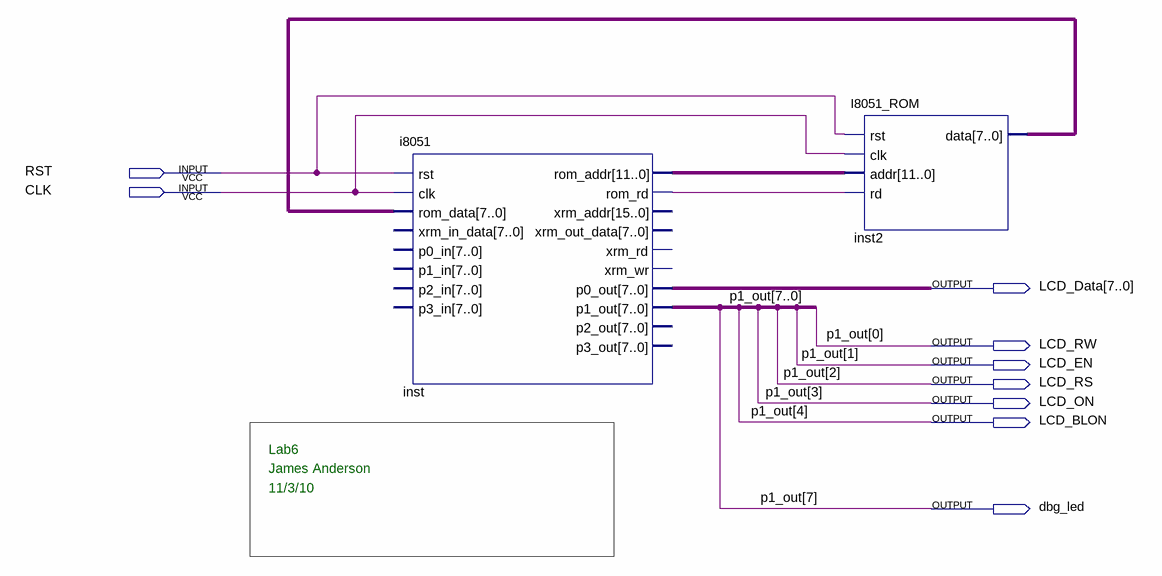
[diagram p0: schematic sheet]
// Quartus schematic Lab6.bdf as structural Verilog: 2 symbols, 9 pins
module Lab6 (
  input  RST,
  input  CLK,
  output [7:0] LCD_Data,
  output LCD_RW,
  output LCD_EN,
  output LCD_RS,
  output LCD_ON,
  output LCD_BLON,
  output dbg_led
);

  wire inst_rom_rd;
  wire [6:5] p1_out;
  wire [7:0] inst2_data;
  wire [11:0] inst_rom_addr;

  i8051 inst (
    .rst(RST), .clk(CLK), .rom_data(inst2_data), .rom_addr(inst_rom_addr), .rom_rd(inst_rom_rd),
    .p0_out(LCD_Data), .p1_out({dbg_led, p1_out, LCD_BLON, LCD_ON, LCD_RS, LCD_EN, LCD_RW}));  // open: xrm_in_data, p0_in, p1_in, p2_in, p3_in, xrm_addr, xrm_out_data, xrm_rd, xrm_wr, p2_out, p3_out
  I8051_ROM inst2 (.rst(RST), .clk(CLK), .addr(inst_rom_addr), .rd(inst_rom_rd), .data(inst2_data));

  // Other names for the same wires on the sheet: p1_out (some bits) = {dbg_led, LCD_BLON, LCD_ON, LCD_RS, LCD_EN, LCD_RW}

  // Notes on the sheet:
  //   Lab6
  //   James Anderson
  //   11/3/10
endmodule
